# EAGLE design CAN Line (EAGLE 8.5.1)
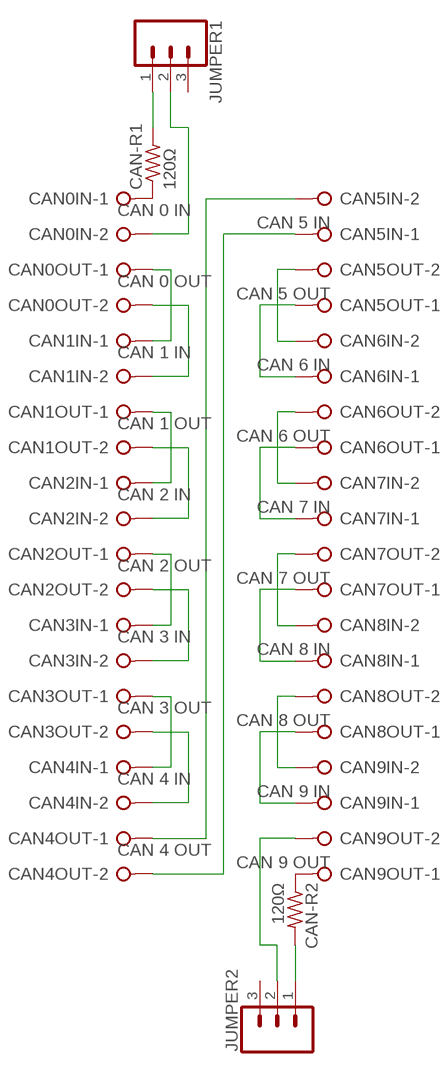
[diagram p0: schematic, sheet 1]

## Parts
CAN0IN  CAN 0 IN  W237-02P  [W237-132]
CAN0OUT  CAN 0 OUT  W237-02P  [W237-132]
CAN1IN  CAN 1 IN  W237-02P  [W237-132]
CAN1OUT  CAN 1 OUT  W237-02P  [W237-132]
CAN2IN  CAN 2 IN  W237-02P  [W237-132]
CAN2OUT  CAN 2 OUT  W237-02P  [W237-132]
CAN3IN  CAN 3 IN  W237-02P  [W237-132]
CAN3OUT  CAN 3 OUT  W237-02P  [W237-132]
CAN4IN  CAN 4 IN  W237-02P  [W237-132]
CAN4OUT  CAN 4 OUT  W237-02P  [W237-132]
CAN5IN  CAN 5 IN  W237-02P  [W237-132]
CAN5OUT  CAN 5 OUT  W237-02P  [W237-132]
CAN6IN  CAN 6 IN  W237-02P  [W237-132]
CAN6OUT  CAN 6 OUT  W237-02P  [W237-132]
CAN7IN  CAN 7 IN  W237-02P  [W237-132]
CAN7OUT  CAN 7 OUT  W237-02P  [W237-132]
CAN8IN  CAN 8 IN  W237-02P  [W237-132]
CAN8OUT  CAN 8 OUT  W237-02P  [W237-132]
CAN9IN  CAN 9 IN  W237-02P  [W237-132]
CAN9OUT  CAN 9 OUT  W237-02P  [W237-132]
CAN-R1  120Ω  R-US_0207/10  [0207/10]
CAN-R2  120Ω  R-US_0207/10  [0207/10]
JUMPER1  CONN_03  [1X03]
JUMPER2  CONN_03  [1X03]

## Nets
N$1: CAN0IN.1 CAN-R1.1
N$2: CAN0IN.2 JUMPER1.2
N$3: CAN0OUT.1 CAN1IN.1
N$4: CAN0OUT.2 CAN1IN.2
N$5: CAN1OUT.1 CAN2IN.1
N$6: CAN1OUT.2 CAN2IN.2
N$7: CAN2OUT.1 CAN3IN.1
N$8: CAN2OUT.2 CAN3IN.2
N$9: CAN3OUT.1 CAN4IN.1
N$10: CAN3OUT.2 CAN4IN.2
N$11: CAN4OUT.1 CAN5IN.2
N$12: CAN4OUT.2 CAN5IN.1
N$13: CAN5OUT.2 CAN6IN.2
N$14: CAN5OUT.1 CAN6IN.1
N$15: CAN6OUT.2 CAN7IN.2
N$16: CAN6OUT.1 CAN7IN.1
N$17: CAN7OUT.2 CAN8IN.2
N$18: CAN7OUT.1 CAN8IN.1
N$19: CAN8OUT.2 CAN9IN.2
N$20: CAN8OUT.1 CAN9IN.1
N$21: CAN9OUT.2 JUMPER2.2
N$22: CAN9OUT.1 CAN-R2.1
N$23: CAN-R2.2 JUMPER2.1
N$24: CAN-R1.2 JUMPER1.1
Unconnected: JUMPER1.3 JUMPER2.3

## Library data of the parts
CAN0IN CAN0OUT CAN1IN CAN1OUT CAN2IN CAN2OUT CAN3IN CAN3OUT CAN4IN CAN4OUT CAN5IN CAN5OUT CAN6IN CAN6OUT CAN7IN CAN7OUT CAN8IN CAN8OUT CAN9IN CAN9OUT = con-wago-508:W237-02P: WAGO SREW CLAMP; OC_FARNELL: unknown; OC_NEWARK: unknown
CAN-R1 CAN-R2 = resistor:R-US_: RESISTOR, American symbol
JUMPER1 JUMPER2 = SparkFun-Connectors:CONN_03: Multi connection point. Often used as Generic Header-pin footprint for 0.1 inch spaced/style header connections On any of the 0.1 inch spaced packages, you can populate with these: Break Away Headers - Straight <https://www.sparkfun.com/products/116> (PRT-00116) Break Away Male Headers - Right Angle <https://www.sparkfun.com/products/553> (PRT-00553) Female Headers <https://www.sparkfun.com/products/115> (PRT-00115) Break Away Headers - Machine Pin <https://www.sparkfun.com/products/117> (PRT-00117) Break Away Female Headers - Swiss Machine Pin <https://www.sparkfun.com/products/743> (PRT-00743) Stackable Header - 3 Pin (Female, 0.1") <https://www.sparkfun.com/products/13875> (PRT-13875) For SCREWTERMINALS and SPRING TERMINALS visit here: Screw Terimnals on SparkFun.com <https://www.sparkfun.com/search/results?term=Screw+Terminals> (5mm/3.5mm/2.54mm spacing) This device is also useful as a general connection point to wire up your design to another part of your project. Our various solder wires solder well into these plated through hole pads. Hook-Up Wire - Assortment (Stranded, 22 AWG) <https://www.sparkfun.com/products/11375> (PRT-11375) Hook-Up Wire - Assortment (Solid Core, 22 AWG) <https://www.sparkfun.com/products/11367> (PRT-11367) View the entire wire category on our website here <https://www.sparkfun.com/categories/141> Special notes: Molex polarized connector foot print use with SKU : PRT-08232 with associated crimp pins and housings.

## Board
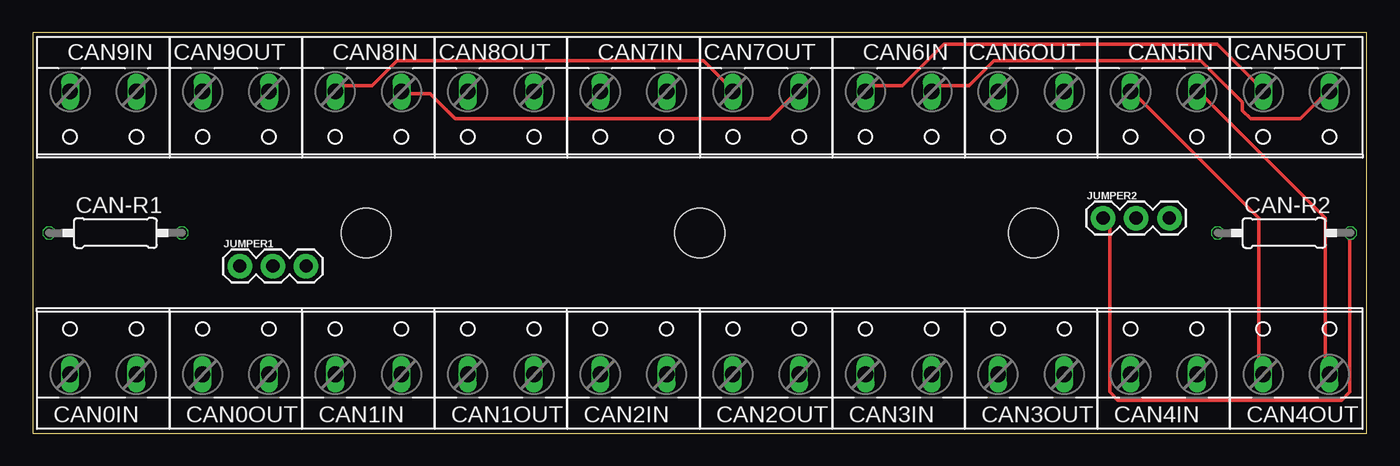
[diagram p1: board, top side]
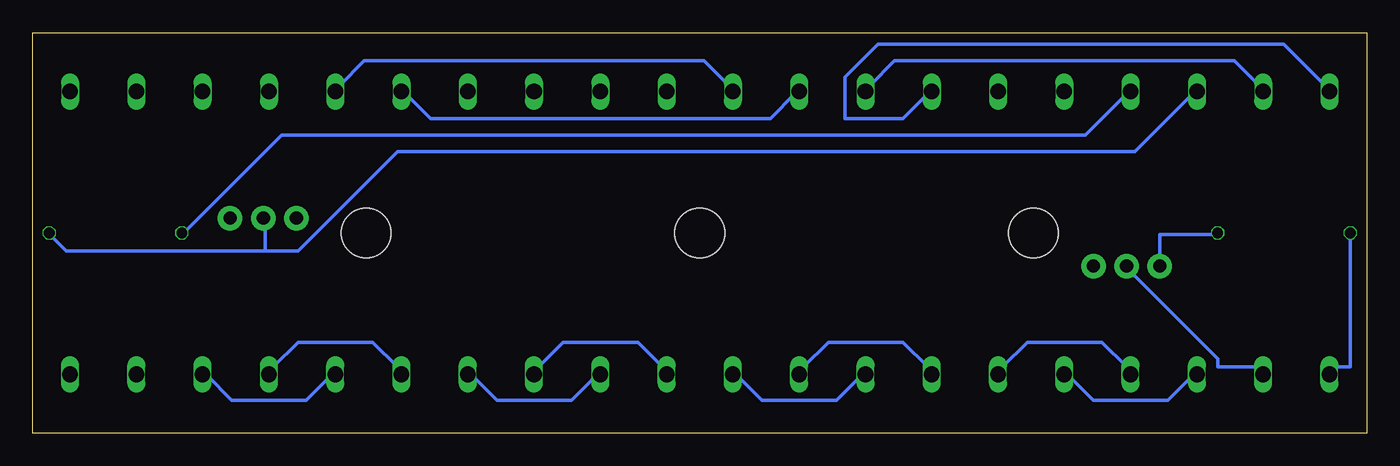
[diagram p2: board, bottom side, seen from below]

Size 102.26 x 30.73 mm. Coordinates in mm from the lower left corner, seen from the top.
Outline: 0,0 102.26,0 102.26,30.73 0,30.73 0,0
Copper layers (1*16): Top 0.0356mm / dielectric 1.5011mm / Bottom 0.0356mm
Design rules "SilverCircuits": minimum track width 10mil, minimum drill 15mil, track to track 16mil, track to pad 16mil, pad to pad 16mil, via to via 16mil, smd to smd 0mil, copper to edge 20mil, drill to drill 20mil, minimum pad ring 4mil, minimum via ring 8mil, stop-mask expansion 4mil, vias tented up to drill 0mil, thermal gap 10mil
Holes 3.81 mm at 51.13,15.37 76.7,15.37 25.57,15.37

### Footprints (pad centres in the part's own frame; a part is rotated, then mirrored left to right if it is on the bottom)
W237-132 = drill 1.194 long: 1 -2.54,-0.635; 2 2.54,-0.635
0207/10 = drill 0.813 octagon: 1 -5.08,0; 2 5.08,0
1X03 = drill 1.016 pad 1.88: 1 0,0; 2 2.54,0; 3 5.08,0

### Placement (x,y rotation side)
CAN0IN  5.41,5.16 0 top
CAN0OUT  15.57,5.16 0 top
CAN1IN  25.73,5.16 0 top
CAN1OUT  35.89,5.16 0 top
CAN2IN  46.05,5.16 0 top
CAN2OUT  56.21,5.16 0 top
CAN3IN  66.37,5.16 0 top
CAN3OUT  76.53,5.16 0 top
CAN4IN  86.69,5.16 0 top
CAN4OUT  96.85,5.16 0 top
CAN5IN  86.69,25.58 180 top
CAN5OUT  96.85,25.58 180 top
CAN6IN  66.37,25.58 180 top
CAN6OUT  76.53,25.58 180 top
CAN7IN  46.05,25.58 180 top
CAN7OUT  56.21,25.58 180 top
CAN8IN  25.73,25.58 180 top
CAN8OUT  35.89,25.58 180 top
CAN9IN  5.41,25.58 180 top
CAN9OUT  15.57,25.58 180 top
CAN-R1  6.35,15.37 0 top
CAN-R2  95.91,15.37 0 top
JUMPER1  15.88,12.83 0 top
JUMPER2  82.04,16.51 0 top

### Tracks (layer width: path | path; a pad name or v marks a point on that pad's centre or on a via)
N$1
  Bottom 0.254: CAN-R1.1 1.27,5.08 2.54,5.08 CAN0IN.1
N$2
  Bottom 0.254: CAN0IN.2 8.26,5.08 11.43,5.08 11.43,5.71 18.41,12.7 JUMPER1.2
N$3
  Bottom 0.254: CAN0OUT.1 13.34,4.45 15.24,2.54 20.95,2.54 22.86,4.45 CAN1IN.1
N$4
  Bottom 0.254: CAN0OUT.2 18.41,5.08 20.32,6.99 26.04,6.99 27.94,5.08 CAN1IN.2
N$5
  Bottom 0.254: CAN1OUT.1 33.66,5.08 35.56,6.99 41.27,6.99 43.18,5.08 CAN2IN.1
N$6
  Bottom 0.254: CAN1OUT.2 38.73,4.45 40.64,2.54 46.35,2.54 48.26,4.45 CAN2IN.2
N$7
  Bottom 0.254: CAN2OUT.1 53.98,5.08 55.88,6.99 61.59,6.99 63.5,5.08 CAN3IN.1
N$8
  Bottom 0.254: CAN2OUT.2 59.05,4.45 60.96,2.54 66.67,2.54 68.58,4.45 CAN3IN.2
N$9
  Bottom 0.254: CAN3OUT.1 74.3,5.08 76.2,6.99 81.92,6.99 83.82,5.08 CAN4IN.1
N$10
  Bottom 0.254: CAN3OUT.2 79.38,4.45 81.28,2.54 87,2.54 88.9,4.45 CAN4IN.2
N$11
  Top 0.254: CAN4OUT.1 93.98,5.08 93.98,16.51 84.45,26.04 CAN5IN.2
N$12
  Top 0.254: CAN4OUT.2 99.06,5.08 99.06,16.51 89.53,26.04 CAN5IN.1
N$13
  Top 0.254: CAN6IN.2 64.14,26.67 66.67,26.67 69.85,29.84 90.81,29.84 93.98,26.67 CAN5OUT.2
N$14
  Top 0.254: CAN6IN.1 69.22,26.67 71.75,26.67 73.66,28.57 89.53,28.57 92.71,25.4 92.71,24.77 93.34,24.13 97.16,24.13 99.06,26.04 CAN5OUT.1
N$15
  Bottom 0.254: CAN7IN.2 43.81,26.04 45.72,24.13 71.75,24.13 73.66,26.04 CAN6OUT.2
N$16
  Bottom 0.254: CAN7IN.1 48.9,26.67 50.8,28.57 76.83,28.57 78.74,26.67 CAN6OUT.1
N$17
  Top 0.254: CAN8IN.2 23.5,26.67 26.04,26.67 27.94,28.57 51.44,28.57 53.34,26.67 CAN7OUT.2
N$18
  Top 0.254: CAN8IN.1 28.57,26.04 30.48,26.04 32.38,24.13 56.52,24.13 58.42,26.04 CAN7OUT.1
N$19
  Bottom 0.254: CAN9IN.2 3.17,26.67 6.35,29.84 37.47,29.84 40.01,27.3 40.01,24.13 35.56,24.13 33.66,26.04 CAN8OUT.2
N$20
  Bottom 0.254: CAN9IN.1 8.26,26.67 10.16,28.57 36.2,28.57 38.1,26.67 CAN8OUT.1
N$21
  Bottom 0.254: 100.97,15.24 99.69,13.97 84.45,13.97 | 84.45,13.97 81.92,13.97 74.3,21.59 17.78,21.59 13.34,26.04 CAN9OUT.2 | 84.45,13.97 84.45,16.51 JUMPER2.2
N$22
  Bottom 0.254: CAN-R2.1 90.81,15.24 83.19,22.86 21.59,22.86 18.41,26.04 CAN9OUT.1
N$23
  Top 0.254: CAN-R2.2 100.97,15.24 100.97,3.17 100.33,2.54 83.19,2.54 82.55,3.17 82.55,16.51 JUMPER2.1
N$24
  Bottom 0.254: JUMPER1.1 15.88,15.24 11.43,15.24 CAN-R1.2

### Text on the board
tValues: RoboLoCo / Team 5338 | Line Board v3